# EAGLE design thermocouple (EAGLE 9.0.0)
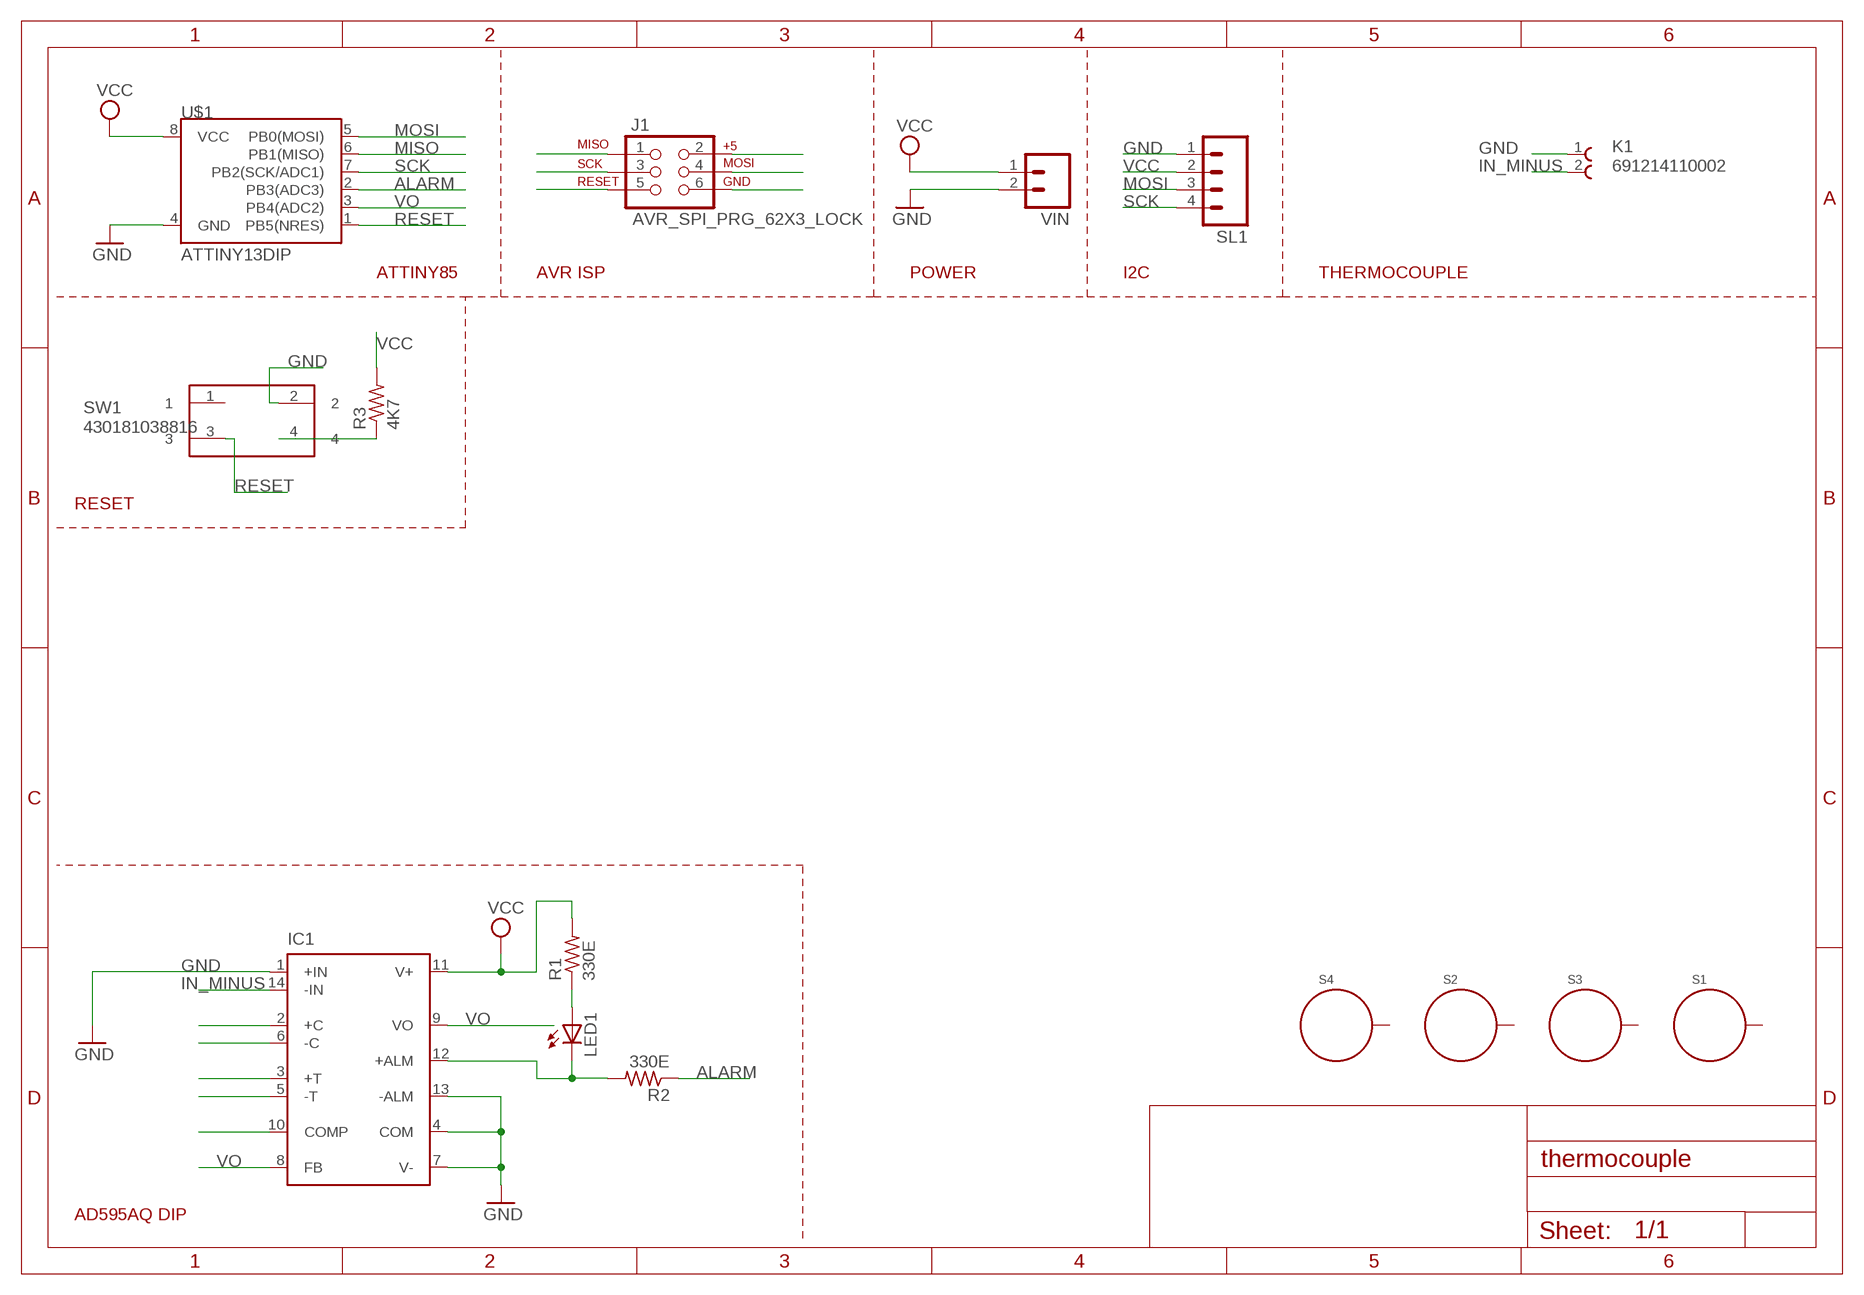
[diagram p0: schematic, sheet 1]

## Parts
IC1  AD595  [DIL14]
J1  AVR_SPI_PRG_62X3_LOCK  [2X3_LOCK]
K1  691214110002  [691214110002]
LED1  LEDCHIPLED_0805  [CHIPLED_0805]
R1  330E  R-US_M0805  [M0805]
R2  330E  R-US_M0805  [M0805]
R3  4K7  R-US_M0805  [M0805]
S1  STANDOFF_ELECTRICAL  [STANDOFF-ELECTRICAL]
S2  STANDOFF_ELECTRICAL  [STANDOFF-ELECTRICAL]
S3  STANDOFF_ELECTRICAL  [STANDOFF-ELECTRICAL]
S4  STANDOFF_ELECTRICAL  [STANDOFF-ELECTRICAL]
SL1  M04  [04P]
SW1  430181038816  [430181038816]
U$1  ATTINY13DIP  [DIP08]
VIN  M02  [02P]

## Nets
ALARM: R2.1 U$1.2(PB3(ADC3))
GND: IC1.1(+IN) IC1.4(COM) IC1.7(V-) IC1.13(-ALM) J1.6 K1.1 SL1.1 SW1.2 U$1.4(GND) VIN.2
IN_MINUS: IC1.14(-IN) K1.2
MISO: J1.1 U$1.6(PB1(MISO))
MOSI: J1.4 SL1.3 U$1.5(PB0(MOSI))
N$1: LED1.A R1.1
N$3: IC1.2(+C)
N$4: IC1.6(-C)
N$5: IC1.3(+T)
N$6: IC1.5(-T)
N$7: IC1.10(COMP)
N$12: IC1.12(+ALM) LED1.C R2.2
N$428: R3.1 SW1.4
RESET: J1.5 SW1.3 U$1.1(PB5(NRES))
SCK: J1.3 SL1.4 U$1.7(PB2(SCK/ADC1))
VCC: IC1.11(V+) J1.2 R1.2 R3.2 SL1.2 U$1.8(VCC) VIN.1
VO: IC1.8(FB) IC1.9(VO) U$1.3(PB4(ADC2))
Unconnected: S1.P1 S2.P1 S3.P1 S4.P1 SW1.1

## Notes on the sheet
- ATTINY85 | AVR ISP | POWER | I2C | THERMOCOUPLE
- RESET
- AD595AQ DIP

## Library data of the parts
IC1 = analog-devices:AD595: ANALOG DEVICES; MPN: AD595AQ; OC_FARNELL: 409194; OC_NEWARK: 06WX1596
J1 = SparkFun-Connectors:AVR_SPI_PRG_6: AVR ISP 6 Pin This is the reduced ISP connector for AVR programming. Common on Arduino. This footprint will take up less PCB space and can be used with a 10-pin to 6-pin adapter such as SKU: BOB-08508
K1 = Wuerth_Elektronik_eiCan_Terminal_Blocks_Connectors:691214110002: WR-TBL Serie 2141 - 3.5mm Horizontal Entry Modular with Rising Cage Clamp - 1.3 mm2 Wires, 2 Pins=>Code : Con_TBL_Screw_RisingClamp_3.50_691214110002 <http://katalog.we-online.de/media/images/eican/Con_TBL_Screw_RisingClamp_3.50_6912141100xx_pf2.jpg> Details see: http://katalog.we-online.de/en/em/691_214_110_0xx Created 2014-06-18, Karrer Zheng 2014 (C) Würth Elektronik
LED1 = adafruit:LED: LED OSRAM: - CHIPLED LG R971, LG N971, LY N971, LG Q971, LY Q971, LO R971, LY R971 LH N974, LH R974 LS Q976, LO Q976, LY Q976 LO Q996 - Hyper CHIPLED LW Q18S LB Q993, LB Q99A, LB R99A - SideLED LS A670, LO A670, LY A670, LG A670, LP A670 LB A673, LV A673, LT A673, LW A673 LH A674 LY A675 LS A676, LA A676, LO A676, LY A676, LW A676 LS A679, LY A679, LG A679 - Hyper Micro SIDELED® LS Y876, LA Y876, LO Y876, LY Y876 LT Y87S - SmartLED LW L88C, LW L88S LB L89C, LB L89S, LG L890 LS L89K, LO L89K, LY L89K LS L896, LA L896, LO L896, LY L896 - TOPLED LS T670, LO T670, LY T670, LG T670, LP T670 LSG T670, LSP T670, LSY T670, LOP T670, LYG T670 LG T671, LOG T671, LSG T671 LB T673, LV T673, LT T673, LW T673 LH T674 LS T676, LA T676, LO T676, LY T676, LB T676, LH T676, LSB T676, LW T676 LB T67C, LV T67C, LT T67C, LS T67K, LO T67K, LY T67K, LW E67C LS E67B, LA E67B, LO E67B, LY E67B, LB E67C, LV E67C, LT E67C LW T67C LS T679, LY T679, LG T679 LS T770, LO T770, LY T770, LG T770, LP T770 LB T773, LV T773, LT T773, LW T773 LH T774 LS E675, LA E675, LY E675, LS T675 LS T776, LA T776, LO T776, LY T776, LB T776 LHGB T686 LT T68C, LB T68C - Hyper Mini TOPLED® LB M676 - Mini TOPLED Santana® LG M470 LS M47K, LO M47K, LY M47K Source: http://www.osram.convergy.de/
R1-R3 = adafruit:R-US_: RESISTOR, American symbol
S1-S4 = SparkFun-Electromechanical:STANDOFF_ELECTRICAL: A standoff intended to be an electrically connected point. Pad size and stop size allow for a #4 Phillips pan screw head to make a solid connection to the board.
SL1 = con-amp-quick:M04: AMP QUICK CONNECTOR; OC_FARNELL: unknown; OC_NEWARK: unknown
SW1 = Eagle_Wuerth_Elektronik_Switch:430181038816: WS-TSS-4.5x4.5 mm SMD Tact Switch,4 pins
U$1 = SparkFun-DigitalIC:ATTINY13: Atmel 8-pin 1kB flash uC
VIN = con-amp-quick:M02: AMP QUICK CONNECTOR; OC_FARNELL: unknown; OC_NEWARK: unknown

## Board
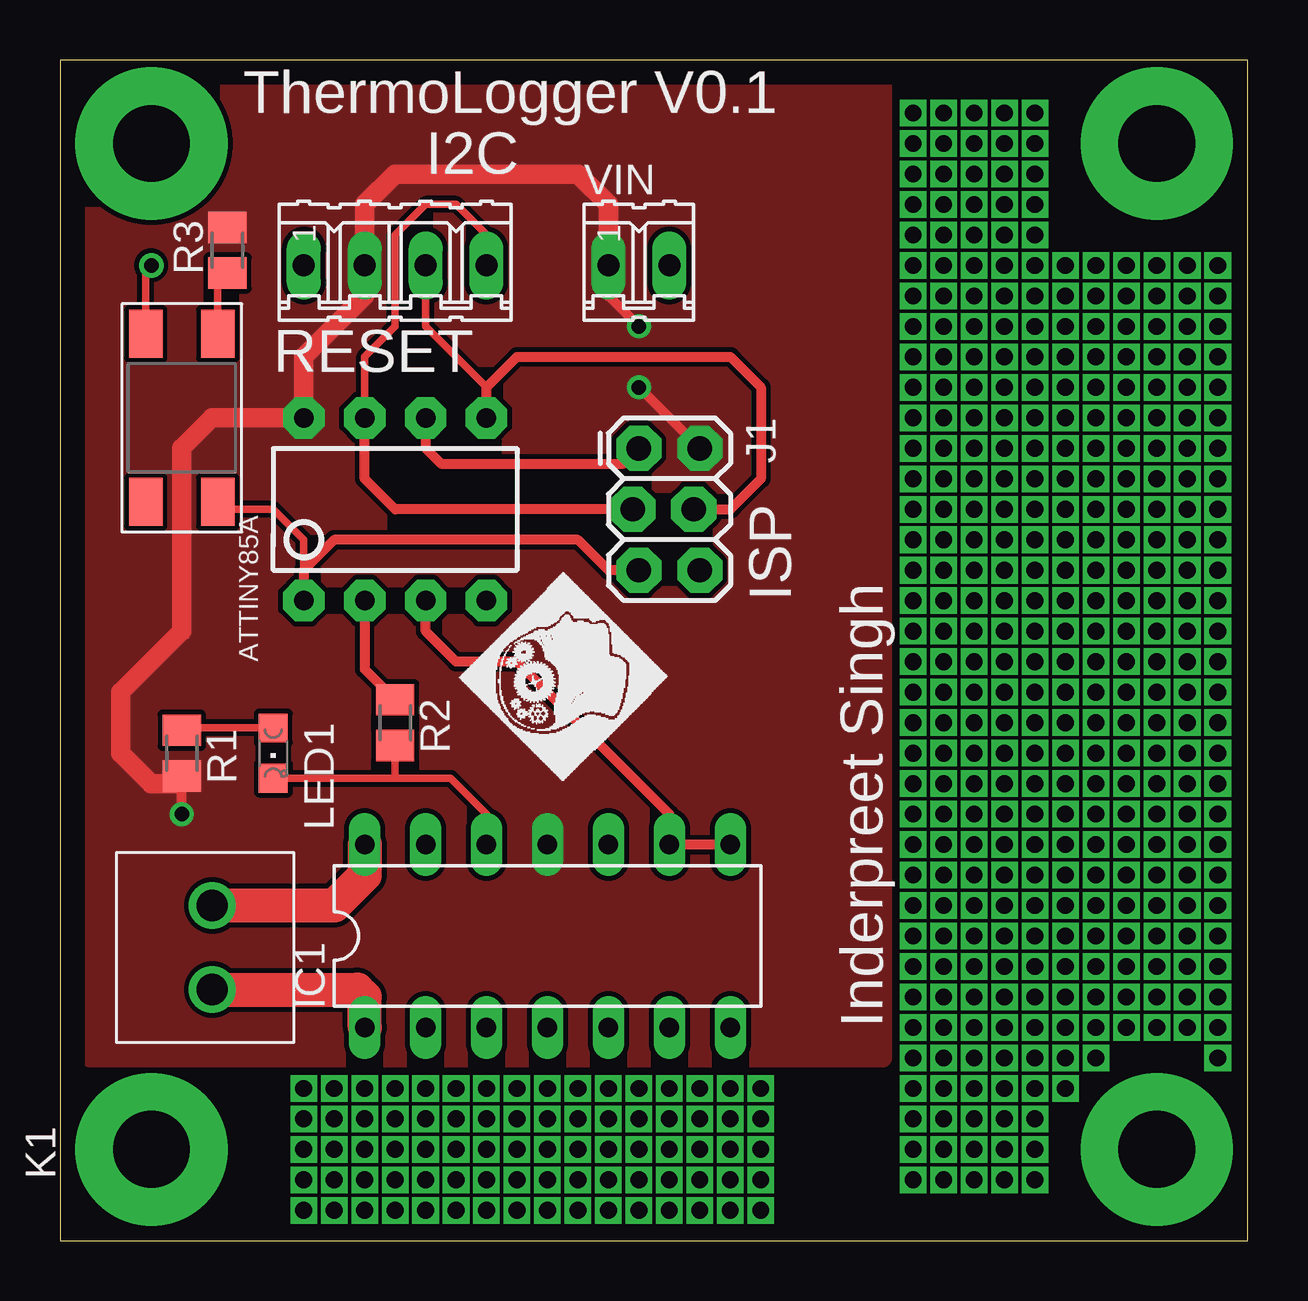
[diagram p1: board, top side]
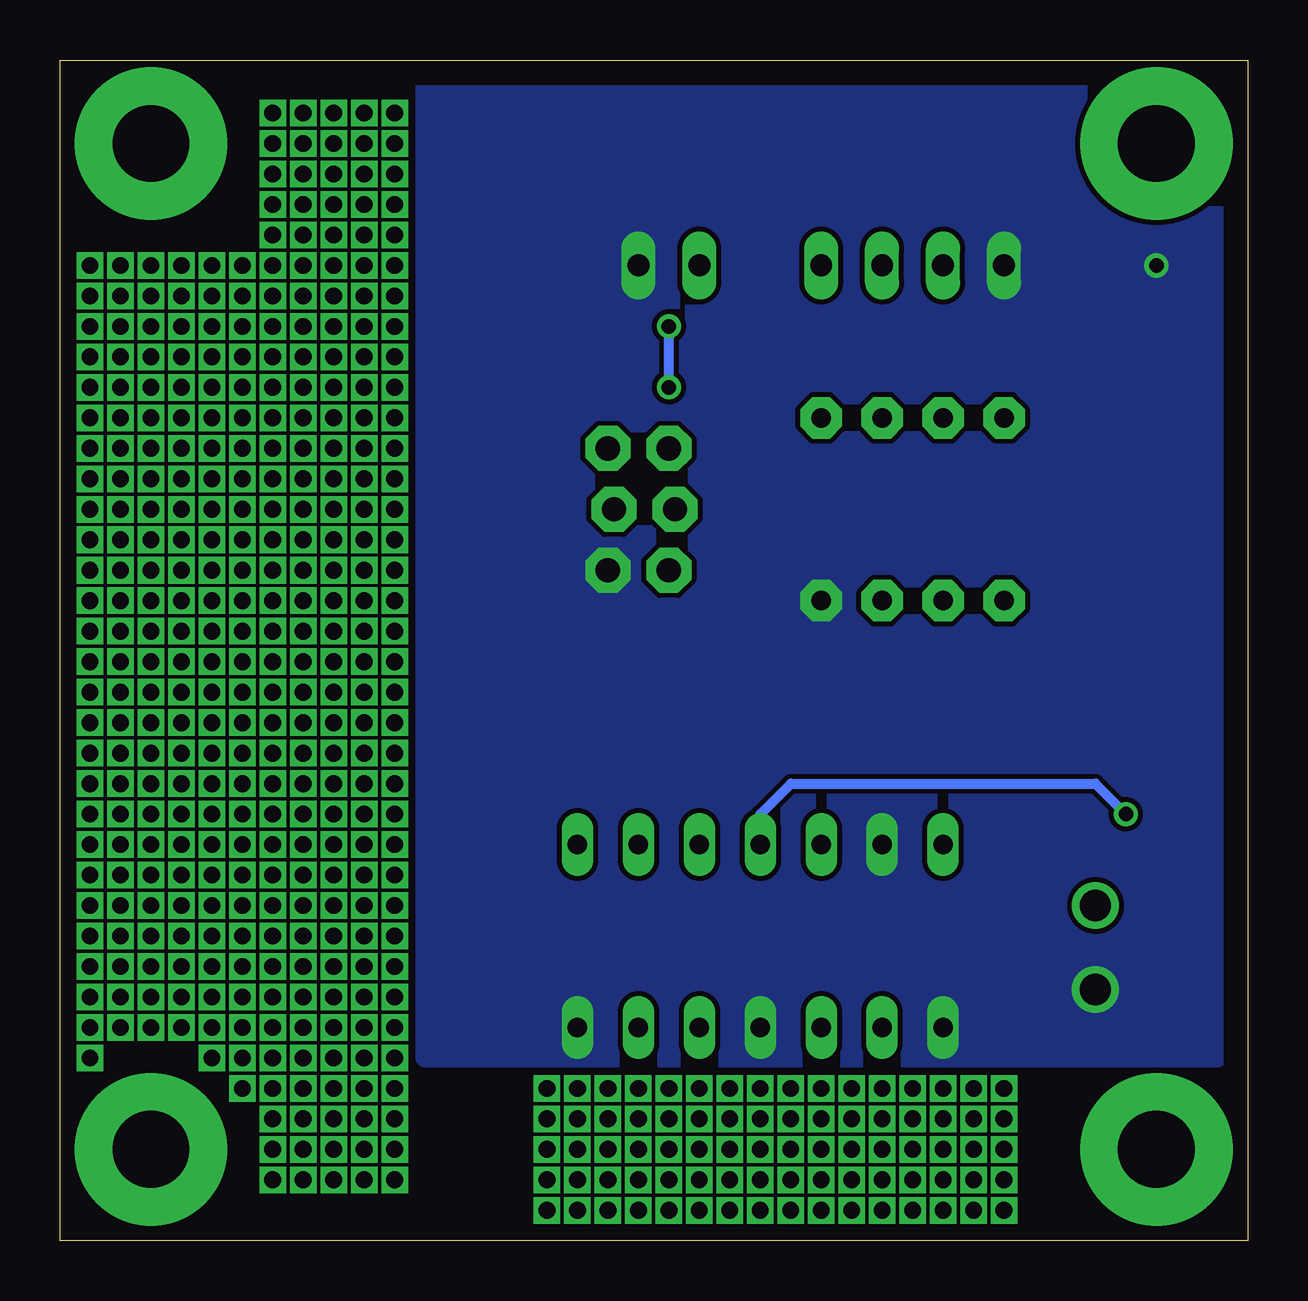
[diagram p2: board, bottom side, seen from below]

Size 49.51 x 49.2 mm. Coordinates in mm from the lower left corner, seen from the top.
Outline: 0,0 49.51,0 49.51,49.2 0,49.2 0,0
Copper layers (1*16): Top 0.035mm / dielectric 1.5mm / Bottom 0.035mm
Design rules "default": minimum track width 10mil, minimum drill 24mil, track to track 8mil, track to pad 8mil, pad to pad 8mil, via to via 8mil, smd to smd 8mil, copper to edge 40mil, drill to drill 8mil, minimum pad ring 10mil, minimum via ring 8mil, stop-mask expansion 4mil, vias tented up to drill 0mil, thermal gap 10mil

### Footprints (pad centres in the part's own frame; a part is rotated, then mirrored left to right if it is on the bottom)
DIL14 = drill 0.813 long: 1 -7.62,-3.81; 2 -5.08,-3.81; 3 -2.54,-3.81; 4 0,-3.81; 5 2.54,-3.81; 6 5.08,-3.81; 7 7.62,-3.81; 8 7.62,3.81; 9 5.08,3.81; 10 2.54,3.81; 11 0,3.81; 12 -2.54,3.81; 13 -5.08,3.81; 14 -7.62,3.81
2X3_LOCK = drill 1.016 pad 1.88 octagon: 1 0,0; 2 0,2.54; 3 2.54,-0.254; 4 2.54,2.286; 5 5.08,0; 6 5.08,2.54
691214110002 = drill 1.3: 1 -3.5,0; 2 0,0
CHIPLED_0805 = smd 1.2 x 1.2: A 0,-1.05; C 0,1.05
M0805 = smd 1.3 x 1.6: 1 -0.95,0; 2 0.95,0
STANDOFF-ELECTRICAL = drill 3.2 pad 6.35: P1 0,0
04P = drill 0.914 long: 1 -3.81,0; 2 -1.27,0; 3 1.27,0; 4 3.81,0
430181038816 = smd 2 x 1.4: 1 -3.5,1.5; 2 3.5,1.5; 3 -3.5,-1.5; 4 3.5,-1.5
DIP08 = drill 0.813 pad 1.727 octagon: 1 -3.81,-3.81; 2 -1.27,-3.81; 3 1.27,-3.81; 4 3.81,-3.81; 5 3.81,3.81; 6 1.27,3.81; 7 -1.27,3.81; 8 -3.81,3.81
02P = drill 0.914 long: 1 -1.27,0; 2 1.27,0

### Placement (x,y rotation side)
IC1  20.32,12.7 0 top
J1  24.13,33.02 270 top
K1  6.35,13.97 90 top
LED1  8.89,20.32 180 top
R1  5.08,20.32 270 top
R2  13.97,21.59 270 top
R3  6.99,41.27 90 top
S1  45.72,3.81 0 top
S2  3.81,45.72 0 top
S3  3.81,3.81 0 top
S4  45.72,45.72 0 top
SL1  13.97,40.64 0 top
SW1  5.08,34.29 90 top
U$1  13.97,30.48 0 top
U$2  [LOGO2]  25.4,19.05 90 top
VIN  24.13,40.64 0 top

### Tracks (layer width: path | path; a pad name or v marks a point on that pad's centre or on a via)
ALARM
  Top 0.406: U$1.2 12.7,23.81 R2.1
GND  (via drill 0.6)
  Top 0.305: SW1.2 3.58,40.41 v3.81,40.64
  Top 1.422: IC1.1 12.7,10.16 12.39,10.47 K1.1
  pour Bottom (no thermals): 1.27,48.26 34.29,48.26 34.29,7.62 1.27,7.62
IN_MINUS
  Top 1.422: IC1.14 12.7,15.24 11.43,13.97 K1.2
MISO
  Top 0.406: U$1.6 15.24,33.02 15.88,32.38 23.5,32.38 J1.1
MOSI
  Top 0.305: SL1.3 15.24,38.1 17.78,35.56
  Top 0.406: J1.4 27.94,30.48 29.21,31.75 29.21,35.56 27.94,36.83 19.05,36.83 17.78,35.56 U$1.5
N$1
  Top 0.305: LED1.A 5.18,21.37 R1.1
N$2  (via drill 0.7)
  other vias: 48.26,40.64
N$8  (via drill 0.7)
  other vias: 48.26,39.37
N$9  (via drill 0.7)
  other vias: 48.26,38.1
N$10  (via drill 0.7)
  other vias: 48.26,36.83
N$11  (via drill 0.7)
  other vias: 48.26,34.29
N$12
  Top 0.305: LED1.C 13.97,19.27 | 13.97,19.27 16.29,19.27 17.78,17.78 IC1.12 | R2.2 13.97,19.27
N$13  (via drill 0.7)
  other vias: 48.26,35.56
N$14  (via drill 0.7)
  other vias: 48.26,33.02
N$15  (via drill 0.7)
  other vias: 48.26,31.75
N$16  (via drill 0.7)
  other vias: 48.26,30.48
N$17  (via drill 0.7)
  other vias: 48.26,29.21
N$18  (via drill 0.7)
  other vias: 48.26,27.94
N$19  (via drill 0.7)
  other vias: 48.26,25.4
N$20  (via drill 0.7)
  other vias: 48.26,26.67
N$21  (via drill 0.7)
  other vias: 48.26,24.13
N$22  (via drill 0.7)
  other vias: 46.99,40.64
N$23  (via drill 0.7)
  other vias: 46.99,39.37
N$24  (via drill 0.7)
  other vias: 46.99,38.1
N$25  (via drill 0.7)
  other vias: 46.99,36.83
N$26  (via drill 0.7)
  other vias: 46.99,34.29
N$27  (via drill 0.7)
  other vias: 46.99,35.56
N$28  (via drill 0.7)
  other vias: 46.99,33.02
N$29  (via drill 0.7)
  other vias: 46.99,31.75
N$30  (via drill 0.7)
  other vias: 46.99,30.48
N$31  (via drill 0.7)
  other vias: 46.99,29.21
N$32  (via drill 0.7)
  other vias: 46.99,27.94
N$33  (via drill 0.7)
  other vias: 46.99,25.4
N$34  (via drill 0.7)
  other vias: 46.99,26.67
N$35  (via drill 0.7)
  other vias: 46.99,24.13
N$36  (via drill 0.7)
  other vias: 45.72,40.64
N$37  (via drill 0.7)
  other vias: 45.72,39.37
N$38  (via drill 0.7)
  other vias: 45.72,38.1
N$39  (via drill 0.7)
  other vias: 45.72,36.83
N$40  (via drill 0.7)
  other vias: 45.72,34.29
N$41  (via drill 0.7)
  other vias: 45.72,35.56
N$42  (via drill 0.7)
  other vias: 45.72,33.02
N$43  (via drill 0.7)
  other vias: 45.72,31.75
N$44  (via drill 0.7)
  other vias: 45.72,30.48
N$45  (via drill 0.7)
  other vias: 45.72,29.21
N$46  (via drill 0.7)
  other vias: 45.72,27.94
N$47  (via drill 0.7)
  other vias: 45.72,25.4
N$48  (via drill 0.7)
  other vias: 45.72,26.67
N$49  (via drill 0.7)
  other vias: 45.72,24.13
N$50  (via drill 0.7)
  other vias: 44.45,40.64
N$51  (via drill 0.7)
  other vias: 44.45,39.37
N$52  (via drill 0.7)
  other vias: 44.45,38.1
N$53  (via drill 0.7)
  other vias: 44.45,36.83
N$54  (via drill 0.7)
  other vias: 44.45,34.29
N$55  (via drill 0.7)
  other vias: 44.45,35.56
N$56  (via drill 0.7)
  other vias: 44.45,33.02
N$57  (via drill 0.7)
  other vias: 44.45,31.75
N$58  (via drill 0.7)
  other vias: 44.45,30.48
N$59  (via drill 0.7)
  other vias: 44.45,29.21
N$60  (via drill 0.7)
  other vias: 44.45,27.94
N$61  (via drill 0.7)
  other vias: 44.45,25.4
N$62  (via drill 0.7)
  other vias: 44.45,26.67
N$63  (via drill 0.7)
  other vias: 44.45,24.13
N$64  (via drill 0.7)
  other vias: 43.18,40.64
N$65  (via drill 0.7)
  other vias: 43.18,39.37
N$66  (via drill 0.7)
  other vias: 43.18,38.1
N$67  (via drill 0.7)
  other vias: 43.18,36.83
N$68  (via drill 0.7)
  other vias: 43.18,34.29
N$69  (via drill 0.7)
  other vias: 43.18,35.56
N$70  (via drill 0.7)
  other vias: 43.18,33.02
N$71  (via drill 0.7)
  other vias: 43.18,31.75
N$72  (via drill 0.7)
  other vias: 43.18,30.48
N$73  (via drill 0.7)
  other vias: 43.18,29.21
N$74  (via drill 0.7)
  other vias: 43.18,27.94
N$75  (via drill 0.7)
  other vias: 43.18,25.4
N$76  (via drill 0.7)
  other vias: 43.18,26.67
N$77  (via drill 0.7)
  other vias: 43.18,24.13
N$78  (via drill 0.7)
  other vias: 41.91,40.64
N$79  (via drill 0.7)
  other vias: 41.91,39.37
N$80  (via drill 0.7)
  other vias: 41.91,38.1
N$81  (via drill 0.7)
  other vias: 41.91,36.83
N$82  (via drill 0.7)
  other vias: 41.91,34.29
N$83  (via drill 0.7)
  other vias: 41.91,35.56
N$84  (via drill 0.7)
  other vias: 41.91,33.02
N$85  (via drill 0.7)
  other vias: 41.91,31.75
N$86  (via drill 0.7)
  other vias: 41.91,30.48
N$87  (via drill 0.7)
  other vias: 41.91,29.21
N$88  (via drill 0.7)
  other vias: 41.91,27.94
N$89  (via drill 0.7)
  other vias: 41.91,25.4
N$90  (via drill 0.7)
  other vias: 41.91,26.67
N$91  (via drill 0.7)
  other vias: 41.91,24.13
N$92  (via drill 0.7)
  other vias: 40.64,40.64
N$93  (via drill 0.7)
  other vias: 40.64,39.37
N$94  (via drill 0.7)
  other vias: 40.64,38.1
N$95  (via drill 0.7)
  other vias: 40.64,36.83
N$96  (via drill 0.7)
  other vias: 40.64,34.29
N$97  (via drill 0.7)
  other vias: 40.64,35.56
N$98  (via drill 0.7)
  other vias: 40.64,33.02
N$99  (via drill 0.7)
  other vias: 40.64,31.75
N$100  (via drill 0.7)
  other vias: 40.64,30.48
N$101  (via drill 0.7)
  other vias: 40.64,29.21
N$102  (via drill 0.7)
  other vias: 40.64,27.94
N$103  (via drill 0.7)
  other vias: 40.64,25.4
N$104  (via drill 0.7)
  other vias: 40.64,26.67
N$105  (via drill 0.7)
  other vias: 40.64,24.13
N$106  (via drill 0.7)
  other vias: 39.37,40.64
N$107  (via drill 0.7)
  other vias: 39.37,39.37
N$108  (via drill 0.7)
  other vias: 39.37,38.1
N$109  (via drill 0.7)
  other vias: 39.37,36.83
N$110  (via drill 0.7)
  other vias: 39.37,34.29
N$111  (via drill 0.7)
  other vias: 39.37,35.56
N$112  (via drill 0.7)
  other vias: 39.37,33.02
N$113  (via drill 0.7)
  other vias: 39.37,31.75
N$114  (via drill 0.7)
  other vias: 39.37,30.48
N$115  (via drill 0.7)
  other vias: 39.37,29.21
N$116  (via drill 0.7)
  other vias: 39.37,27.94
N$117  (via drill 0.7)
  other vias: 39.37,25.4
N$118  (via drill 0.7)
  other vias: 39.37,26.67
N$119  (via drill 0.7)
  other vias: 39.37,24.13
N$120  (via drill 0.7)
  other vias: 48.26,22.86
N$121  (via drill 0.7)
  other vias: 48.26,21.59
N$122  (via drill 0.7)
  other vias: 48.26,20.32
N$123  (via drill 0.7)
  other vias: 48.26,19.05
N$124  (via drill 0.7)
  other vias: 48.26,16.51
N$125  (via drill 0.7)
  other vias: 48.26,17.78
N$126  (via drill 0.7)
  other vias: 48.26,15.24
N$127  (via drill 0.7)
  other vias: 48.26,13.97
N$128  (via drill 0.7)
  other vias: 48.26,12.7
N$129  (via drill 0.7)
  other vias: 48.26,11.43
N$130  (via drill 0.7)
  other vias: 48.26,10.16
N$131  (via drill 0.7)
  other vias: 48.26,7.62
N$132  (via drill 0.7)
  other vias: 48.26,8.89
N$133  (via drill 0.7)
  other vias: 38.1,40.64
N$134  (via drill 0.7)
  other vias: 46.99,22.86
N$135  (via drill 0.7)
  other vias: 46.99,21.59
N$136  (via drill 0.7)
  other vias: 46.99,20.32
N$137  (via drill 0.7)
  other vias: 46.99,19.05
N$138  (via drill 0.7)
  other vias: 46.99,16.51
N$139  (via drill 0.7)
  other vias: 46.99,17.78
N$140  (via drill 0.7)
  other vias: 46.99,15.24
N$141  (via drill 0.7)
  other vias: 46.99,13.97
N$142  (via drill 0.7)
  other vias: 46.99,12.7
N$143  (via drill 0.7)
  other vias: 46.99,11.43
N$144  (via drill 0.7)
  other vias: 46.99,10.16
N$145  (via drill 0.7)
  other vias: 38.1,39.37
N$146  (via drill 0.7)
  other vias: 46.99,8.89
N$147  (via drill 0.7)
  other vias: 38.1,38.1
N$148  (via drill 0.7)
  other vias: 45.72,22.86
N$149  (via drill 0.7)
  other vias: 45.72,21.59
N$150  (via drill 0.7)
  other vias: 45.72,20.32
N$151  (via drill 0.7)
  other vias: 45.72,19.05
N$152  (via drill 0.7)
  other vias: 45.72,16.51
N$153  (via drill 0.7)
  other vias: 45.72,17.78
N$154  (via drill 0.7)
  other vias: 45.72,15.24
N$155  (via drill 0.7)
  other vias: 45.72,13.97
N$156  (via drill 0.7)
  other vias: 45.72,12.7
N$157  (via drill 0.7)
  other vias: 45.72,11.43
N$158  (via drill 0.7)
  other vias: 45.72,10.16
N$159  (via drill 0.7)
  other vias: 38.1,36.83
N$160  (via drill 0.7)
  other vias: 45.72,8.89
N$161  (via drill 0.7)
  other vias: 38.1,34.29
N$162  (via drill 0.7)
  other vias: 44.45,22.86
N$163  (via drill 0.7)
  other vias: 44.45,21.59
N$164  (via drill 0.7)
  other vias: 44.45,20.32
N$165  (via drill 0.7)
  other vias: 44.45,19.05
N$166  (via drill 0.7)
  other vias: 44.45,16.51
N$167  (via drill 0.7)
  other vias: 44.45,17.78
N$168  (via drill 0.7)
  other vias: 44.45,15.24
N$169  (via drill 0.7)
  other vias: 44.45,13.97
N$170  (via drill 0.7)
  other vias: 44.45,12.7
N$171  (via drill 0.7)
  other vias: 44.45,11.43
N$172  (via drill 0.7)
  other vias: 44.45,10.16
N$173  (via drill 0.7)
  other vias: 38.1,35.56
N$174  (via drill 0.7)
  other vias: 44.45,8.89
N$175  (via drill 0.7)
  other vias: 38.1,33.02
N$176  (via drill 0.7)
  other vias: 43.18,22.86
N$177  (via drill 0.7)
  other vias: 43.18,21.59
N$178  (via drill 0.7)
  other vias: 43.18,20.32
N$179  (via drill 0.7)
  other vias: 43.18,19.05
N$180  (via drill 0.7)
  other vias: 43.18,16.51
N$181  (via drill 0.7)
  other vias: 43.18,17.78
N$182  (via drill 0.7)
  other vias: 43.18,15.24
N$183  (via drill 0.7)
  other vias: 43.18,13.97
N$184  (via drill 0.7)
  other vias: 43.18,12.7
N$185  (via drill 0.7)
  other vias: 43.18,11.43
N$186  (via drill 0.7)
  other vias: 43.18,10.16
N$187  (via drill 0.7)
  other vias: 43.18,7.62
N$188  (via drill 0.7)
  other vias: 43.18,8.89
N$189  (via drill 0.7)
  other vias: 38.1,31.75
N$190  (via drill 0.7)
  other vias: 41.91,22.86
N$191  (via drill 0.7)
  other vias: 41.91,21.59
N$192  (via drill 0.7)
  other vias: 41.91,20.32
N$193  (via drill 0.7)
  other vias: 41.91,19.05
N$194  (via drill 0.7)
  other vias: 41.91,16.51
N$195  (via drill 0.7)
  other vias: 41.91,17.78
N$196  (via drill 0.7)
  other vias: 41.91,15.24
N$197  (via drill 0.7)
  other vias: 41.91,13.97
N$198  (via drill 0.7)
  other vias: 41.91,12.7
N$199  (via drill 0.7)
  other vias: 41.91,11.43
N$200  (via drill 0.7)
  other vias: 41.91,10.16
N$201  (via drill 0.7)
  other vias: 41.91,7.62
N$202  (via drill 0.7)
  other vias: 41.91,8.89
N$203  (via drill 0.7)
  other vias: 41.91,6.35
N$204  (via drill 0.7)
  other vias: 40.64,22.86
N$205  (via drill 0.7)
  other vias: 40.64,21.59
N$206  (via drill 0.7)
  other vias: 40.64,20.32
N$207  (via drill 0.7)
  other vias: 40.64,19.05
N$208  (via drill 0.7)
  other vias: 40.64,16.51
N$209  (via drill 0.7)
  other vias: 40.64,17.78
N$210  (via drill 0.7)
  other vias: 40.64,15.24
N$211  (via drill 0.7)
  other vias: 40.64,13.97
N$212  (via drill 0.7)
  other vias: 40.64,12.7
N$213  (via drill 0.7)
  other vias: 40.64,11.43
N$214  (via drill 0.7)
  other vias: 40.64,10.16
N$215  (via drill 0.7)
  other vias: 40.64,7.62
N$216  (via drill 0.7)
  other vias: 40.64,8.89
N$217  (via drill 0.7)
  other vias: 40.64,6.35
N$218  (via drill 0.7)
  other vias: 39.37,22.86
N$219  (via drill 0.7)
  other vias: 39.37,21.59
N$220  (via drill 0.7)
  other vias: 39.37,20.32
N$221  (via drill 0.7)
  other vias: 39.37,19.05
N$222  (via drill 0.7)
  other vias: 39.37,16.51
N$223  (via drill 0.7)
  other vias: 39.37,17.78
N$224  (via drill 0.7)
  other vias: 39.37,15.24
N$225  (via drill 0.7)
  other vias: 39.37,13.97
N$226  (via drill 0.7)
  other vias: 39.37,12.7
N$227  (via drill 0.7)
  other vias: 39.37,11.43
N$228  (via drill 0.7)
  other vias: 39.37,10.16
N$229  (via drill 0.7)
  other vias: 39.37,7.62
N$230  (via drill 0.7)
  other vias: 39.37,8.89
N$231  (via drill 0.7)
  other vias: 39.37,6.35
N$232  (via drill 0.7)
  other vias: 38.1,30.48
N$233  (via drill 0.7)
  other vias: 38.1,29.21
N$234  (via drill 0.7)
  other vias: 38.1,27.94
N$235  (via drill 0.7)
  other vias: 38.1,25.4
N$236  (via drill 0.7)
  other vias: 38.1,26.67
N$237  (via drill 0.7)
  other vias: 38.1,24.13
N$238  (via drill 0.7)
  other vias: 36.83,40.64
N$239  (via drill 0.7)
  other vias: 36.83,39.37
N$240  (via drill 0.7)
  other vias: 36.83,38.1
N$241  (via drill 0.7)
  other vias: 36.83,36.83
N$242  (via drill 0.7)
  other vias: 36.83,34.29
N$243  (via drill 0.7)
  other vias: 36.83,35.56
N$244  (via drill 0.7)
  other vias: 36.83,33.02
N$245  (via drill 0.7)
  other vias: 36.83,31.75
N$246  (via drill 0.7)
  other vias: 36.83,30.48
N$247  (via drill 0.7)
  other vias: 36.83,29.21
N$248  (via drill 0.7)
  other vias: 36.83,27.94
N$249  (via drill 0.7)
  other vias: 36.83,25.4
N$250  (via drill 0.7)
  other vias: 36.83,26.67
N$251  (via drill 0.7)
  other vias: 36.83,24.13
N$252  (via drill 0.7)
  other vias: 35.56,40.64
N$253  (via drill 0.7)
  other vias: 35.56,39.37
N$254  (via drill 0.7)
  other vias: 35.56,38.1
N$255  (via drill 0.7)
  other vias: 35.56,36.83
N$256  (via drill 0.7)
  other vias: 35.56,34.29
N$257  (via drill 0.7)
  other vias: 35.56,35.56
N$258  (via drill 0.7)
  other vias: 35.56,33.02
N$259  (via drill 0.7)
  other vias: 35.56,31.75
N$260  (via drill 0.7)
  other vias: 35.56,30.48
N$261  (via drill 0.7)
  other vias: 35.56,29.21
N$262  (via drill 0.7)
  other vias: 35.56,27.94
N$263  (via drill 0.7)
  other vias: 35.56,25.4
N$264  (via drill 0.7)
  other vias: 35.56,26.67
N$265  (via drill 0.7)
  other vias: 35.56,24.13
N$266  (via drill 0.7)
  other vias: 38.1,22.86
N$267  (via drill 0.7)
  other vias: 38.1,21.59
N$268  (via drill 0.7)
  other vias: 38.1,20.32
N$269  (via drill 0.7)
  other vias: 38.1,19.05
N$270  (via drill 0.7)
  other vias: 38.1,16.51
N$271  (via drill 0.7)
  other vias: 38.1,17.78
N$272  (via drill 0.7)
  other vias: 38.1,15.24
N$273  (via drill 0.7)
  other vias: 38.1,13.97
N$274  (via drill 0.7)
  other vias: 38.1,12.7
N$275  (via drill 0.7)
  other vias: 38.1,11.43
N$276  (via drill 0.7)
  other vias: 38.1,10.16
N$277  (via drill 0.7)
  other vias: 38.1,7.62
N$278  (via drill 0.7)
  other vias: 38.1,8.89
N$279  (via drill 0.7)
  other vias: 38.1,6.35
N$280  (via drill 0.7)
  other vias: 36.83,22.86
N$281  (via drill 0.7)
  other vias: 36.83,21.59
N$282  (via drill 0.7)
  other vias: 36.83,20.32
N$283  (via drill 0.7)
  other vias: 36.83,19.05
N$284  (via drill 0.7)
  other vias: 36.83,16.51
N$285  (via drill 0.7)
  other vias: 36.83,17.78
N$286  (via drill 0.7)
  other vias: 36.83,15.24
N$287  (via drill 0.7)
  other vias: 36.83,13.97
N$288  (via drill 0.7)
  other vias: 36.83,12.7
N$289  (via drill 0.7)
  other vias: 36.83,11.43
N$290  (via drill 0.7)
  other vias: 36.83,10.16
N$291  (via drill 0.7)
  other vias: 36.83,7.62
N$292  (via drill 0.7)
  other vias: 36.83,8.89
N$293  (via drill 0.7)
  other vias: 36.83,6.35
N$294  (via drill 0.7)
  other vias: 35.56,22.86
N$295  (via drill 0.7)
  other vias: 35.56,21.59
N$296  (via drill 0.7)
  other vias: 35.56,20.32
N$297  (via drill 0.7)
  other vias: 35.56,19.05
N$298  (via drill 0.7)
  other vias: 35.56,16.51
N$299  (via drill 0.7)
  other vias: 35.56,17.78
N$300  (via drill 0.7)
  other vias: 35.56,15.24
N$301  (via drill 0.7)
  other vias: 35.56,13.97
N$302  (via drill 0.7)
  other vias: 35.56,12.7
N$303  (via drill 0.7)
  other vias: 35.56,11.43
N$304  (via drill 0.7)
  other vias: 35.56,10.16
N$305  (via drill 0.7)
  other vias: 35.56,7.62
N$306  (via drill 0.7)
  other vias: 35.56,8.89
N$307  (via drill 0.7)
  other vias: 35.56,6.35
N$308  (via drill 0.7)
  other vias: 40.64,46.99
N$309  (via drill 0.7)
  other vias: 40.64,45.72
N$310  (via drill 0.7)
  other vias: 40.64,44.45
N$311  (via drill 0.7)
  other vias: 40.64,43.18
N$312  (via drill 0.7)
  other vias: 40.64,41.91
N$313  (via drill 0.7)
  other vias: 39.37,46.99
N$314  (via drill 0.7)
  other vias: 39.37,45.72
N$315  (via drill 0.7)
  other vias: 39.37,44.45
N$316  (via drill 0.7)
  other vias: 39.37,43.18
N$317  (via drill 0.7)
  other vias: 39.37,41.91
N$318  (via drill 0.7)
  other vias: 38.1,46.99
N$319  (via drill 0.7)
  other vias: 38.1,45.72
N$320  (via drill 0.7)
  other vias: 38.1,44.45
N$321  (via drill 0.7)
  other vias: 38.1,43.18
N$322  (via drill 0.7)
  other vias: 38.1,41.91
N$323  (via drill 0.7)
  other vias: 36.83,46.99
N$324  (via drill 0.7)
  other vias: 36.83,45.72
N$325  (via drill 0.7)
  other vias: 36.83,44.45
N$326  (via drill 0.7)
  other vias: 36.83,43.18
N$327  (via drill 0.7)
  other vias: 36.83,41.91
N$328  (via drill 0.7)
  other vias: 35.56,46.99
N$329  (via drill 0.7)
  other vias: 35.56,45.72
N$330  (via drill 0.7)
  other vias: 35.56,44.45
N$331  (via drill 0.7)
  other vias: 35.56,43.18
N$332  (via drill 0.7)
  other vias: 35.56,41.91
N$333  (via drill 0.7)
  other vias: 40.64,3.81
N$334  (via drill 0.7)
  other vias: 40.64,5.08
N$335  (via drill 0.7)
  other vias: 40.64,2.54
N$336  (via drill 0.7)
  other vias: 39.37,3.81
N$337  (via drill 0.7)
  other vias: 39.37,5.08
N$338  (via drill 0.7)
  other vias: 39.37,2.54
N$339  (via drill 0.7)
  other vias: 38.1,3.81
N$340  (via drill 0.7)
  other vias: 38.1,5.08
N$341  (via drill 0.7)
  other vias: 38.1,2.54
N$342  (via drill 0.7)
  other vias: 36.83,3.81
N$343  (via drill 0.7)
  other vias: 36.83,5.08
N$344  (via drill 0.7)
  other vias: 36.83,2.54
N$345  (via drill 0.7)
  other vias: 35.56,3.81
N$346  (via drill 0.7)
  other vias: 35.56,5.08
N$347  (via drill 0.7)
  other vias: 35.56,2.54
N$348  (via drill 0.7)
  other vias: 10.16,6.35
N$349  (via drill 0.7)
  other vias: 11.43,6.35
N$350  (via drill 0.7)
  other vias: 10.16,5.08
N$351  (via drill 0.7)
  other vias: 11.43,5.08
N$352  (via drill 0.7)
  other vias: 10.16,3.81
N$353  (via drill 0.7)
  other vias: 11.43,3.81
N$354  (via drill 0.7)
  other vias: 10.16,2.54
N$355  (via drill 0.7)
  other vias: 11.43,2.54
N$356  (via drill 0.7)
  other vias: 10.16,1.27
N$357  (via drill 0.7)
  other vias: 11.43,1.27
N$358  (via drill 0.7)
  other vias: 13.97,6.35
N$359  (via drill 0.7)
  other vias: 12.7,6.35
N$360  (via drill 0.7)
  other vias: 13.97,5.08
N$361  (via drill 0.7)
  other vias: 12.7,5.08
N$362  (via drill 0.7)
  other vias: 13.97,3.81
N$363  (via drill 0.7)
  other vias: 12.7,3.81
N$364  (via drill 0.7)
  other vias: 13.97,2.54
N$365  (via drill 0.7)
  other vias: 12.7,2.54
N$366  (via drill 0.7)
  other vias: 13.97,1.27
N$367  (via drill 0.7)
  other vias: 12.7,1.27
N$368  (via drill 0.7)
  other vias: 15.24,6.35
N$369  (via drill 0.7)
  other vias: 16.51,6.35
N$370  (via drill 0.7)
  other vias: 15.24,5.08
N$371  (via drill 0.7)
  other vias: 16.51,5.08
N$372  (via drill 0.7)
  other vias: 15.24,3.81
N$373  (via drill 0.7)
  other vias: 16.51,3.81
N$374  (via drill 0.7)
  other vias: 15.24,2.54
N$375  (via drill 0.7)
  other vias: 16.51,2.54
N$376  (via drill 0.7)
  other vias: 15.24,1.27
N$377  (via drill 0.7)
  other vias: 16.51,1.27
N$378  (via drill 0.7)
  other vias: 19.05,6.35
N$379  (via drill 0.7)
  other vias: 17.78,6.35
N$380  (via drill 0.7)
  other vias: 19.05,5.08
N$381  (via drill 0.7)
  other vias: 17.78,5.08
N$382  (via drill 0.7)
  other vias: 19.05,3.81
N$383  (via drill 0.7)
  other vias: 17.78,3.81
N$384  (via drill 0.7)
  other vias: 19.05,2.54
N$385  (via drill 0.7)
  other vias: 17.78,2.54
N$386  (via drill 0.7)
  other vias: 19.05,1.27
N$387  (via drill 0.7)
  other vias: 17.78,1.27
N$388  (via drill 0.7)
  other vias: 20.32,6.35
N$389  (via drill 0.7)
  other vias: 21.59,6.35
N$390  (via drill 0.7)
  other vias: 20.32,5.08
N$391  (via drill 0.7)
  other vias: 21.59,5.08
N$392  (via drill 0.7)
  other vias: 20.32,3.81
N$393  (via drill 0.7)
  other vias: 21.59,3.81
N$394  (via drill 0.7)
  other vias: 20.32,2.54
N$395  (via drill 0.7)
  other vias: 21.59,2.54
N$396  (via drill 0.7)
  other vias: 20.32,1.27
N$397  (via drill 0.7)
  other vias: 21.59,1.27
N$398  (via drill 0.7)
  other vias: 24.13,6.35
N$399  (via drill 0.7)
  other vias: 22.86,6.35
N$400  (via drill 0.7)
  other vias: 24.13,5.08
N$401  (via drill 0.7)
  other vias: 22.86,5.08
N$402  (via drill 0.7)
  other vias: 24.13,3.81
N$403  (via drill 0.7)
  other vias: 22.86,3.81
N$404  (via drill 0.7)
  other vias: 24.13,2.54
N$405  (via drill 0.7)
  other vias: 22.86,2.54
N$406  (via drill 0.7)
  other vias: 24.13,1.27
N$407  (via drill 0.7)
  other vias: 22.86,1.27
N$408  (via drill 0.7)
  other vias: 25.4,6.35
N$409  (via drill 0.7)
  other vias: 26.67,6.35
N$410  (via drill 0.7)
  other vias: 25.4,5.08
N$411  (via drill 0.7)
  other vias: 26.67,5.08
N$412  (via drill 0.7)
  other vias: 25.4,3.81
N$413  (via drill 0.7)
  other vias: 26.67,3.81
N$414  (via drill 0.7)
  other vias: 25.4,2.54
N$415  (via drill 0.7)
  other vias: 26.67,2.54
N$416  (via drill 0.7)
  other vias: 25.4,1.27
N$417  (via drill 0.7)
  other vias: 26.67,1.27
N$418  (via drill 0.7)
  other vias: 29.21,6.35
N$419  (via drill 0.7)
  other vias: 27.94,6.35
N$420  (via drill 0.7)
  other vias: 29.21,5.08
N$421  (via drill 0.7)
  other vias: 27.94,5.08
N$422  (via drill 0.7)
  other vias: 29.21,3.81
N$423  (via drill 0.7)
  other vias: 27.94,3.81
N$424  (via drill 0.7)
  other vias: 29.21,2.54
N$425  (via drill 0.7)
  other vias: 27.94,2.54
N$426  (via drill 0.7)
  other vias: 29.21,1.27
N$427  (via drill 0.7)
  other vias: 27.94,1.27
N$428
  Top 0.305: SW1.4 6.58,39.92 R3.1
RESET
  Top 0.305: 10.16,27.94 10.16,29.21 8.89,30.48 6.89,30.48 SW1.3
  Top 0.406: J1.5 22.86,27.94 21.59,29.21 11.43,29.21 10.16,27.94 U$1.1
SCK
  Top 0.305: SL1.4 17.78,41.91 16.51,43.18 15.24,43.18 13.97,41.91 13.97,38.1 12.7,36.83 U$1.7
  Top 0.406: J1.3 13.97,30.48 12.7,31.75 U$1.7
VCC  (via drill 0.6)
  Top 0.406: J1.2 v24.13,35.56 | v24.13,38.1 22.86,39.37 VIN.1 | v5.08,17.78 R1.2
  Top 0.813: R1.2 4.76,19.05 3.81,19.05 2.54,20.32 2.54,22.86 5.08,25.4 5.08,33.02 6.35,34.29 U$1.8 10.16,36.83 12.7,39.37 SL1.2 12.7,43.18 13.97,44.45 21.59,44.45 22.86,43.18 VIN.1
  Bottom 0.406: v24.13,35.56 v24.13,38.1 | IC1.11 20.32,17.78 19.05,19.05 6.35,19.05 v5.08,17.78
  pour Top (no thermals): 1.27,48.26 34.29,48.26 34.29,41.91 34.29,7.62 1.27,7.62 1.27,8.89
VO
  Top 0.406: IC1.8 IC1.9 25.4,17.78 19.05,24.13 16.51,24.13 15.24,25.4 U$1.3

### Text on the board
tNames: ThermoLogger V0.1 | I2C | RESET | ISP | ATTINY85A | Inderpreet Singh